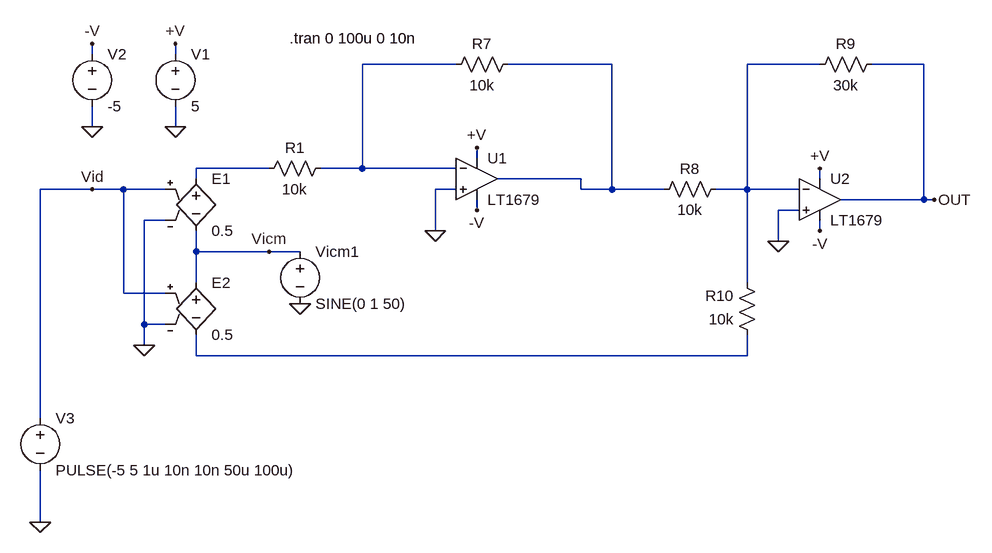
[diagram p0: schematic Etaj_1_AI_2AO_inv_trans.asc]
Etaj_1_AI_2AO_inv_trans.asc, the LTspice schematic file:
Version 4.1
SHEET 1 2052 884
WIRE -240 -176 -240 -192
WIRE -112 -176 -112 -192
WIRE 320 -160 176 -160
WIRE 560 -160 400 -160
WIRE 880 -160 768 -160
WIRE 1040 -160 960 -160
WIRE -240 -64 -240 -96
WIRE -112 -64 -112 -96
WIRE 352 -16 352 -32
WIRE 32 0 -80 0
WIRE 176 0 176 -160
WIRE 176 0 112 0
WIRE 320 0 176 0
WIRE -80 16 -80 0
WIRE 512 16 384 16
WIRE 880 16 880 0
WIRE -240 32 -320 32
WIRE -192 32 -240 32
WIRE -128 32 -192 32
WIRE 320 32 288 32
WIRE 512 32 512 16
WIRE 560 32 560 -160
WIRE 560 32 512 32
WIRE 640 32 560 32
WIRE 768 32 768 -160
WIRE 768 32 720 32
WIRE 848 32 768 32
WIRE 1040 48 1040 -160
WIRE 1040 48 912 48
WIRE 1056 48 1040 48
WIRE 352 64 352 48
WIRE 848 64 816 64
WIRE -128 80 -160 80
WIRE 288 96 288 32
WIRE 880 96 880 80
WIRE 816 112 816 64
WIRE -80 128 -80 96
WIRE 32 128 -80 128
WIRE 80 128 32 128
WIRE -80 176 -80 128
WIRE 768 176 768 32
WIRE -192 192 -192 32
WIRE -128 192 -192 192
WIRE -160 240 -160 80
WIRE -128 240 -160 240
WIRE -160 272 -160 240
WIRE -80 288 -80 256
WIRE 768 288 768 256
WIRE 768 288 -80 288
WIRE -320 384 -320 32
WIRE -320 544 -320 464
FLAG 352 -32 +V
FLAG 352 64 -V
FLAG 880 0 +V
FLAG 880 96 -V
FLAG 1056 48 OUT
FLAG 288 96 0
FLAG 816 112 0
FLAG -320 544 0
FLAG -160 272 0
FLAG 80 208 0
FLAG -240 32 Vid
FLAG 32 128 Vicm
FLAG -112 -64 0
FLAG -112 -192 +V
FLAG -240 -64 0
FLAG -240 -192 -V
SYMBOL res 416 -176 R90
WINDOW 0 0 56 VBottom 2
WINDOW 3 32 56 VTop 2
SYMATTR InstName R7
SYMATTR Value 10k
SYMBOL res 736 16 R90
WINDOW 0 0 56 VBottom 2
WINDOW 3 32 56 VTop 2
SYMATTR InstName R8
SYMATTR Value 10k
SYMBOL res 976 -176 R90
WINDOW 0 0 56 VBottom 2
WINDOW 3 32 56 VTop 2
SYMATTR InstName R9
SYMATTR Value 30k
SYMBOL res 784 272 R180
WINDOW 0 36 76 Left 2
WINDOW 3 36 40 Left 2
SYMATTR InstName R10
SYMATTR Value 10k
SYMBOL e -80 0 R0
SYMATTR InstName E1
SYMATTR Value 0.5
SYMBOL e -80 160 R0
SYMATTR InstName E2
SYMATTR Value 0.5
SYMBOL voltage 80 112 R0
WINDOW 123 0 0 Left 0
WINDOW 39 0 0 Left 0
SYMATTR InstName Vicm1
SYMATTR Value SINE(0 1 50)
SYMBOL voltage -112 -192 R0
WINDOW 123 0 0 Left 2
WINDOW 39 0 0 Left 2
SYMATTR InstName V1
SYMATTR Value 5
SYMBOL voltage -240 -192 R0
WINDOW 123 0 0 Left 2
WINDOW 39 0 0 Left 2
SYMATTR InstName V2
SYMATTR Value -5
SYMBOL res 128 -16 R90
WINDOW 0 0 56 VBottom 2
WINDOW 3 32 56 VTop 2
SYMATTR InstName R1
SYMATTR Value 10k
SYMBOL OpAmps\\LT1679 352 16 R0
SYMATTR InstName U1
SYMBOL OpAmps\\LT1679 880 48 R0
SYMATTR InstName U2
SYMBOL voltage -320 368 R0
WINDOW 123 0 0 Left 0
WINDOW 39 0 0 Left 0
SYMATTR InstName V3
SYMATTR Value PULSE(-5 5 1u 10n 10n 50u 100u)
TEXT 64 -200 Left 2 !.tran 0 100u 0 10n

The netlist it stands for:
* Etaj_1_AI_2AO_inv_trans.asc
R7 N002 N001 10k
R8 N003 N002 10k
R9 OUT N003 30k
R10 N005 N003 10k
E1 N004 Vicm Vid 0 0.5
E2 Vicm N005 Vid 0 0.5
Vicm1 Vicm 0 SINE(0 1 50)
V1 +V 0 5
V2 -V 0 -5
R1 N001 N004 10k
* U1: LT1679 (symbol OpAmps\LT1679 not available, pins judged from their places): In+=0 In-=N001 V+=+V V-=-V OUT=N002
* U2: LT1679 (symbol OpAmps\LT1679 not available, pins judged from their places): In+=0 In-=N003 V+=+V V-=-V OUT=OUT
V3 Vid 0 PULSE(-5 5 1u 10n 10n 50u 100u)
.tran 0 100u 0 10n
.backanno
.end